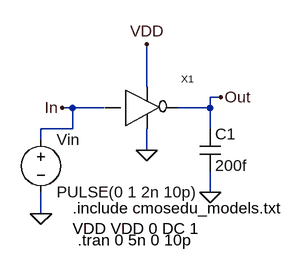
[diagram p0: schematic invert_sim_tran.asc]
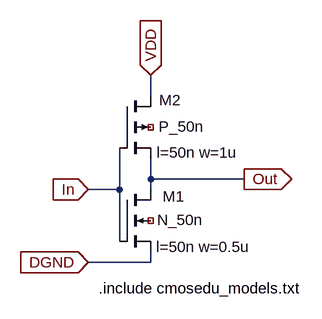
[diagram p1: sub-circuit invert.asc]
invert_sim_tran.asc, the LTspice schematic file:
Version 4
SHEET 1 880 680
WIRE 48 160 48 96
WIRE 160 176 144 176
WIRE -64 192 -80 192
WIRE -16 192 -64 192
WIRE 144 192 144 176
WIRE 144 192 96 192
WIRE -64 224 -64 192
WIRE -64 224 -112 224
WIRE 144 224 144 192
WIRE -112 240 -112 224
WIRE 48 256 48 224
WIRE 144 320 144 288
WIRE -112 352 -112 320
FLAG -80 192 In
FLAG 160 176 Out
FLAG -112 352 0
FLAG 48 256 0
FLAG 48 96 VDD
FLAG 144 320 0
SYMBOL voltage -112 224 R0
WINDOW 123 0 0 Left 2
WINDOW 39 0 0 Left 2
SYMATTR InstName Vin
SYMATTR Value PULSE(0 1 2n 10p)
SYMBOL invert 16 192 R0
SYMATTR InstName X1
SYMBOL cap 128 224 R0
SYMATTR InstName C1
SYMATTR Value 200f
TEXT -64 344 Left 2 !.include cmosedu_models.txt\nVDD VDD 0 DC 1
TEXT -56 392 Left 2 !.tran 0 5n 0 10p

invert.asc, the sub-circuit schematic file:
Version 4
SHEET 1 880 680
WIRE 16 48 16 16
WIRE 16 176 16 144
WIRE 160 176 16 176
WIRE -32 192 -32 128
WIRE -32 192 -80 192
WIRE 16 192 16 176
WIRE -32 272 -32 192
WIRE 16 304 16 288
WIRE 16 304 -80 304
FLAG 16 16 VDD
IOPIN 16 16 In
FLAG -80 192 In
IOPIN -80 192 In
FLAG 160 176 Out
IOPIN 160 176 Out
FLAG -80 304 DGND
IOPIN -80 304 In
SYMBOL nmos4 -32 192 R0
WINDOW 0 66 11 Left 2
WINDOW 3 58 47 Left 2
WINDOW 123 56 88 Left 2
SYMATTR InstName M1
SYMATTR Value N_50n
SYMATTR Value2 l=50n w=0.5u
SYMBOL pmos4 -32 48 R0
WINDOW 0 61 6 Left 2
WINDOW 3 60 47 Left 2
WINDOW 123 57 87 Left 2
SYMATTR InstName M2
SYMATTR Value P_50n
SYMATTR Value2 l=50n w=1u
TEXT -64 344 Left 2 !.include cmosedu_models.txt

The netlist it stands for:
* invert_sim_tran.asc
Vin In 0 PULSE(0 1 2n 10p)
XX1 In VDD 0 Out invert
C1 Out 0 200f

* block symbol definitions
.subckt invert In VDD DGND Out
M1 Out In DGND NC_01 N_50n l=50n w=0.5u
M2 VDD In Out NC_02 P_50n l=50n w=1u
.include cmosedu_models.txt
.ends invert

.model NMOS NMOS
.model PMOS PMOS
.lib standard.mos
.include cmosedu_models.txt
VDD VDD 0 DC 1
.tran 0 5n 0 10p
.backanno
.end

* Results of the author's LTspice run, read from the files saved beside the schematic
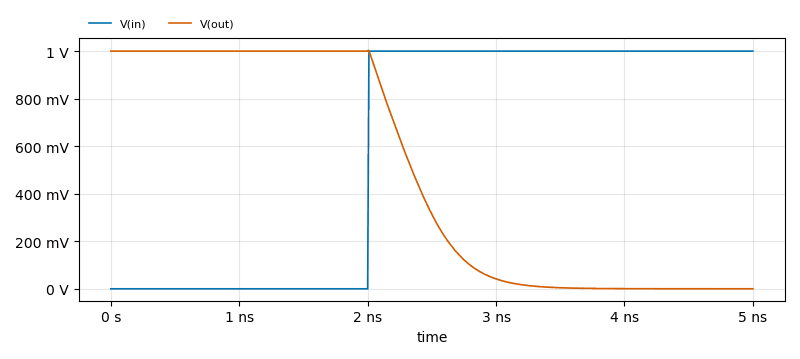
[diagram p2: Transient Analysis of invert_sim_tran.asc, plotted from the saved traces]
* Transient Analysis, 1 run:
*   V(in): min 0 V, max 1 V, average 599 mV, rms 773.8 mV, last 1 V
*   V(out): min 116.2 µV, max 1.003 V, average 480.3 mV, rms 669.8 mV, last 116.2 µV